# EAGLE design PI_Tank_level_controller (EAGLE 9.3.0)
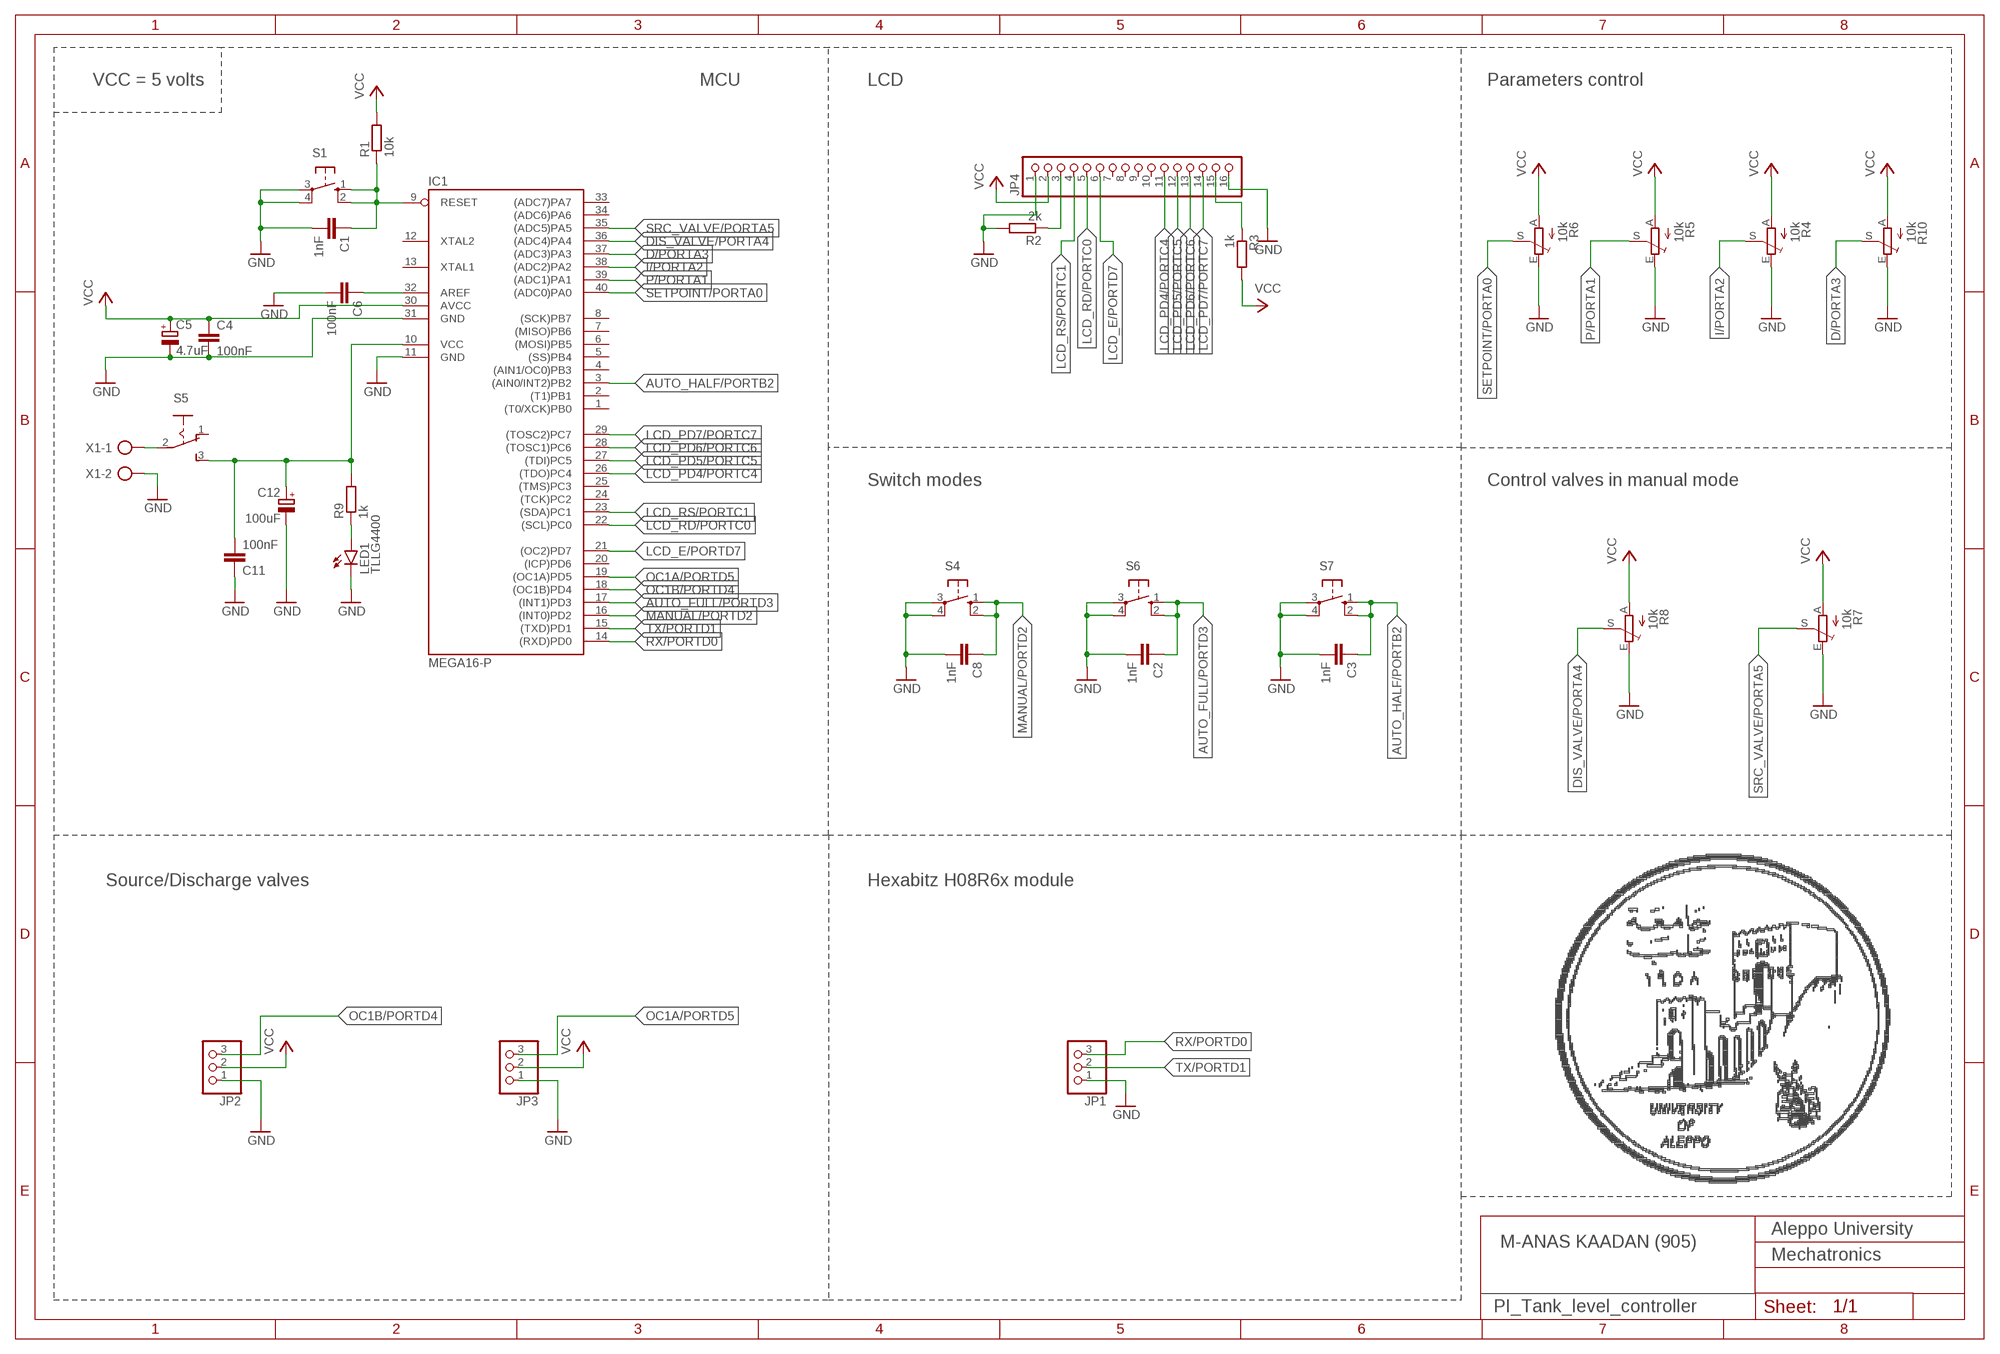
[diagram p0: schematic, sheet 1]

## Parts
C1  1nF  C-EU025-024X044  [C025-024X044]
C2  1nF  C-EU025-024X044  [C025-024X044]
C3  1nF  C-EU025-024X044  [C025-024X044]
C4  100nF  C-EU025-024X044  [C025-024X044]
C5  4.7uF  CPOL-EUE2,5-6E  [E2,5-6E]
C6  100nF  C-EU025-024X044  [C025-024X044]
C8  1nF  C-EU025-024X044  [C025-024X044]
C11  100nF  C-EU025-024X044  [C025-024X044]
C12  100uF  CPOL-EUB45181A  [B45181A]
IC1  MEGA16-P  [DIL40]
JP1  PINHD-1X3  [1X03]
JP2  PINHD-1X3  [1X03]
JP3  PINHD-1X3  [1X03]
JP4  PINHD-1X16  [1X16]
LED1  TLLG4400  [LED3MM]
R1  10k  R-EU_0204/7  [0204/7]
R2  2k  R-EU_0204/7  [0204/7]
R3  1k  R-EU_0204/7  [0204/7]
R4  10k  TRIM_EU-RJ9W  [RJ9W]
R5  10k  TRIM_EU-RJ9W  [RJ9W]
R6  10k  TRIM_EU-RJ9W  [RJ9W]
R7  10k  TRIM_EU-RJ9W  [RJ9W]
R8  10k  TRIM_EU-RJ9W  [RJ9W]
R9  1k  R-EU_0204/7  [0204/7]
R10  10k  TRIM_EU-RJ9W  [RJ9W]
S1  10-XX  [B3F-10XX]
S4  10-XX  [B3F-10XX]
S5  255SB  [255SB]
S6  10-XX  [B3F-10XX]
S7  10-XX  [B3F-10XX]
X1  AK300/2  [AK300/2]

## Nets
AUTO_FULL/PORTD3: C2.1 IC1.17((INT1)PD3) S6.1(S) S6.2(S1)
AUTO_HALF/PORTB2: C3.1 IC1.3((AIN0/INT2)PB2) S7.1(S) S7.2(S1)
D/PORTA3: IC1.37((ADC3)PA3) R10.S
DIS_VALVE/PORTA4: IC1.36((ADC4)PA4) R8.S
GND: C1.2 C2.2 C3.2 C4.2 C5.- C6.2 C8.2 C11.1 C12.- IC1.11(GND) IC1.31(GND) JP1.1 JP2.1 JP3.1 JP4.1 JP4.16 LED1.K(C) R2.2 R4.E R5.E R6.E R7.E R8.E R10.E S1.3(P) S1.4(P1) S4.3(P) S4.4(P1) S6.3(P) S6.4(P1) S7.3(P) S7.4(P1) X1.2
I/PORTA2: IC1.38((ADC2)PA2) R4.S
LCD_E/PORTD7: IC1.21((OC2)PD7) JP4.6
LCD_PD4/PORTC4: IC1.26((TDO)PC4) JP4.11
LCD_PD5/PORTC5: IC1.27((TDI)PC5) JP4.12
LCD_PD6/PORTC6: IC1.28((TOSC1)PC6) JP4.13
LCD_PD7/PORTC7: IC1.29((TOSC2)PC7) JP4.14
LCD_RD/PORTC0: IC1.22((SCL)PC0) JP4.5
LCD_RS/PORTC1: IC1.23((SDA)PC1) JP4.4
MANUAL/PORTD2: C8.1 IC1.16((INT0)PD2) S4.1(S) S4.2(S1)
N$1: C1.1 IC1.9(RESET) R1.1 S1.1(S) S1.2(S1)
N$2: JP4.15 R3.1
N$3: C6.1 IC1.32(AREF)
N$4: JP4.3 R2.1
N$26: S5.2(P) X1.1
N$28: LED1.A R9.1
OC1A/PORTD5: IC1.19((OC1A)PD5) JP3.3
OC1B/PORTD4: IC1.18((OC1B)PD4) JP2.3
P/PORTA1: IC1.39((ADC1)PA1) R5.S
RX/PORTD0: IC1.14((RXD)PD0) JP1.3
SETPOINT/PORTA0: IC1.40((ADC0)PA0) R6.S
SRC_VALVE/PORTA5: IC1.35((ADC5)PA5) R7.S
TX/PORTD1: IC1.15((TXD)PD1) JP1.2
VCC: C4.1 C5.+ C11.2 C12.+ IC1.10(VCC) IC1.30(AVCC) JP2.2 JP3.2 JP4.2 R1.2 R3.2 R4.A R5.A R6.A R7.A R8.A R9.2 R10.A S5.3(S)
Unconnected: IC1.1((T0/XCK)PB0) IC1.2((T1)PB1) IC1.4((AIN1/OC0)PB3) IC1.5((SS)PB4) IC1.6((MOSI)PB5) IC1.7((MISO)PB6) IC1.8((SCK)PB7) IC1.12(XTAL2) IC1.13(XTAL1) IC1.20((ICP)PD6) IC1.24((TCK)PC2) IC1.25((TMS)PC3) IC1.33((ADC7)PA7) IC1.34((ADC6)PA6) JP4.7 JP4.8 JP4.9 JP4.10 S5.1(O)

## Notes on the sheet
- VCC = 5 volts | MCU | LCD | Parameters control
- Switch modes | Control valves in manual mode
- Source/Discharge valves | Hexabitz H08R6x module
- Aleppo University
- M-ANAS KAADAN (905)
- Mechatronics

## Library data of the parts
C1-C4 C6 C8 = rcl:C-EU: CAPACITOR, European symbol; SPICEPREFIX: C
C5 = rcl:CPOL-EU: POLARIZED CAPACITOR, European symbol; SPICEPREFIX: C
C11 = rcl:C-EU: CAPACITOR, European symbol
C12 = rcl:CPOL-EU: POLARIZED CAPACITOR, European symbol
IC1 = atmel:MEGA16-P: MICROCONTROLLER 16 Kbytes FLASH 1 kbytes SRAM 512 bytes EEPROM USART 8-channel 10 bit ADC Source: avr.lbr; MPN: ATMEGA16-16PU; OC_FARNELL: 9171142; OC_NEWARK: 01M6885
JP1-JP3 = pinhead:PINHD-1X3: PIN HEADER
JP4 = pinhead:PINHD-1X16: PIN HEADER
LED1 = led:TLLG4400: Low Current (2mA) LED 3 mm Tinted Diffused Package color GREEN Source: Data sheet <http://www.farnell.com/datasheets/391098.pdf>; MF: VISHAY SEMICONDUCTOR; OC_FARNELL: 1612435
R1-R3 = rcl:R-EU_: RESISTOR, European symbol; SPICEPREFIX: R
R4-R8 R10 = pot:TRIM_EU-: POTENTIOMETER
R9 = rcl:R-EU_: RESISTOR, European symbol
S1 S4 S6 S7 = switch-omron:10-XX: OMRON SWITCH; MPN: B3F-1000; OC_FARNELL: 176432; OC_NEWARK: 36M3542
S5 = switch:255SB: SLIDING SWITCH Distributor Buerklin, 11G810
X1 = con-ptr500:AK300/2: CONNECTOR; OC_FARNELL: unknown; OC_NEWARK: unknown

## Board
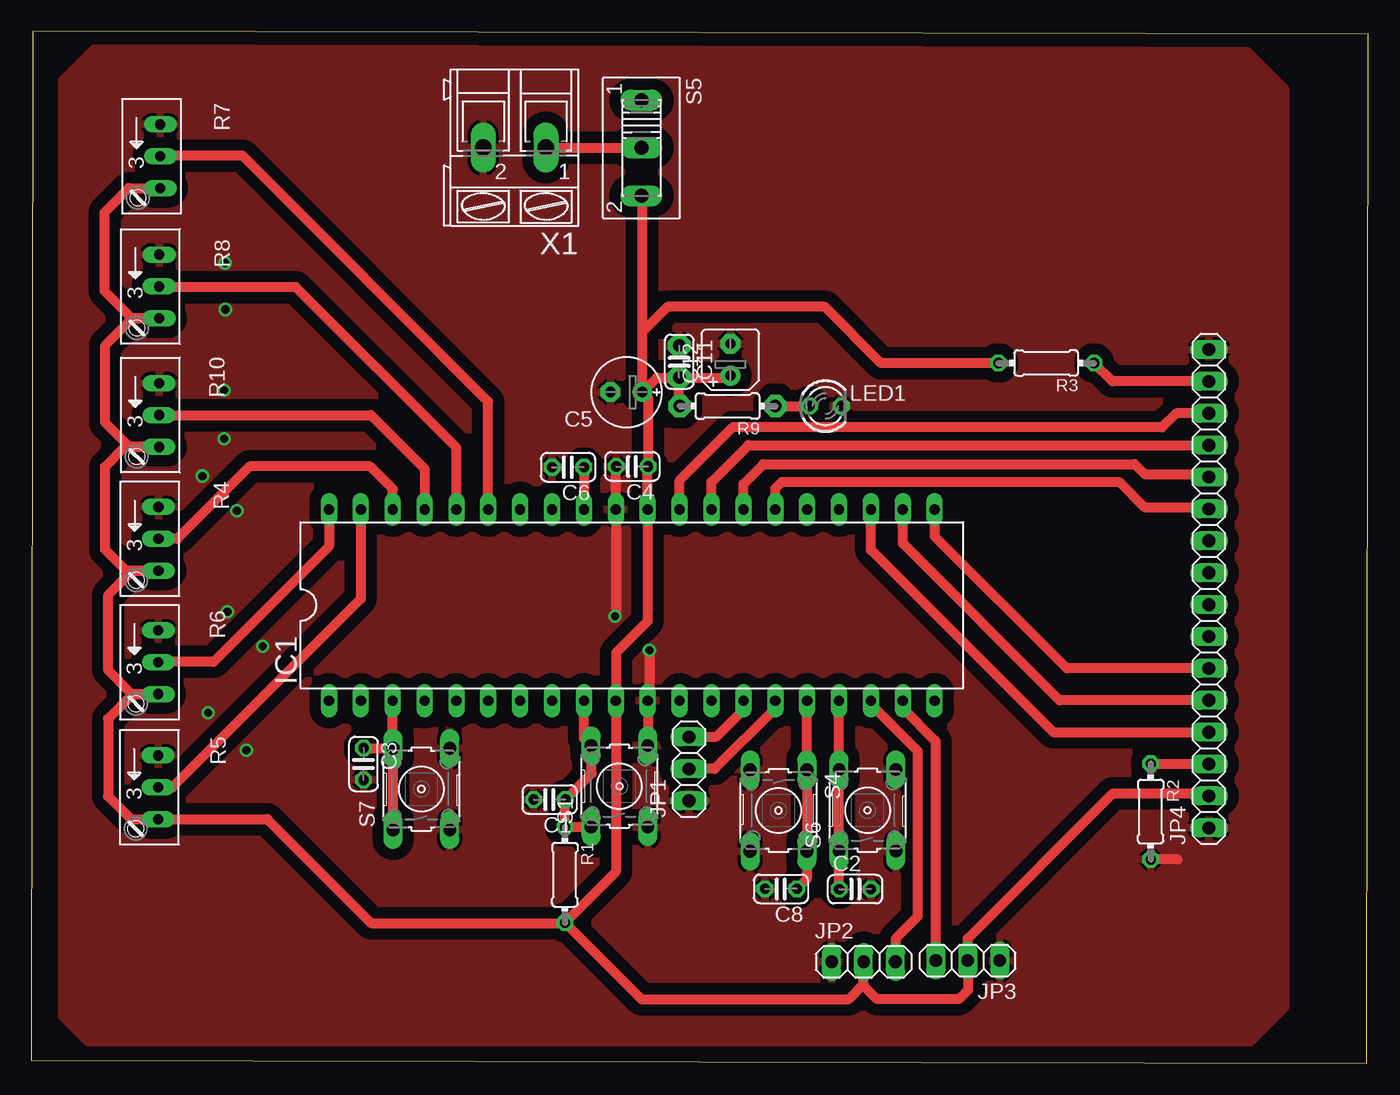
[diagram p1: board, top side]
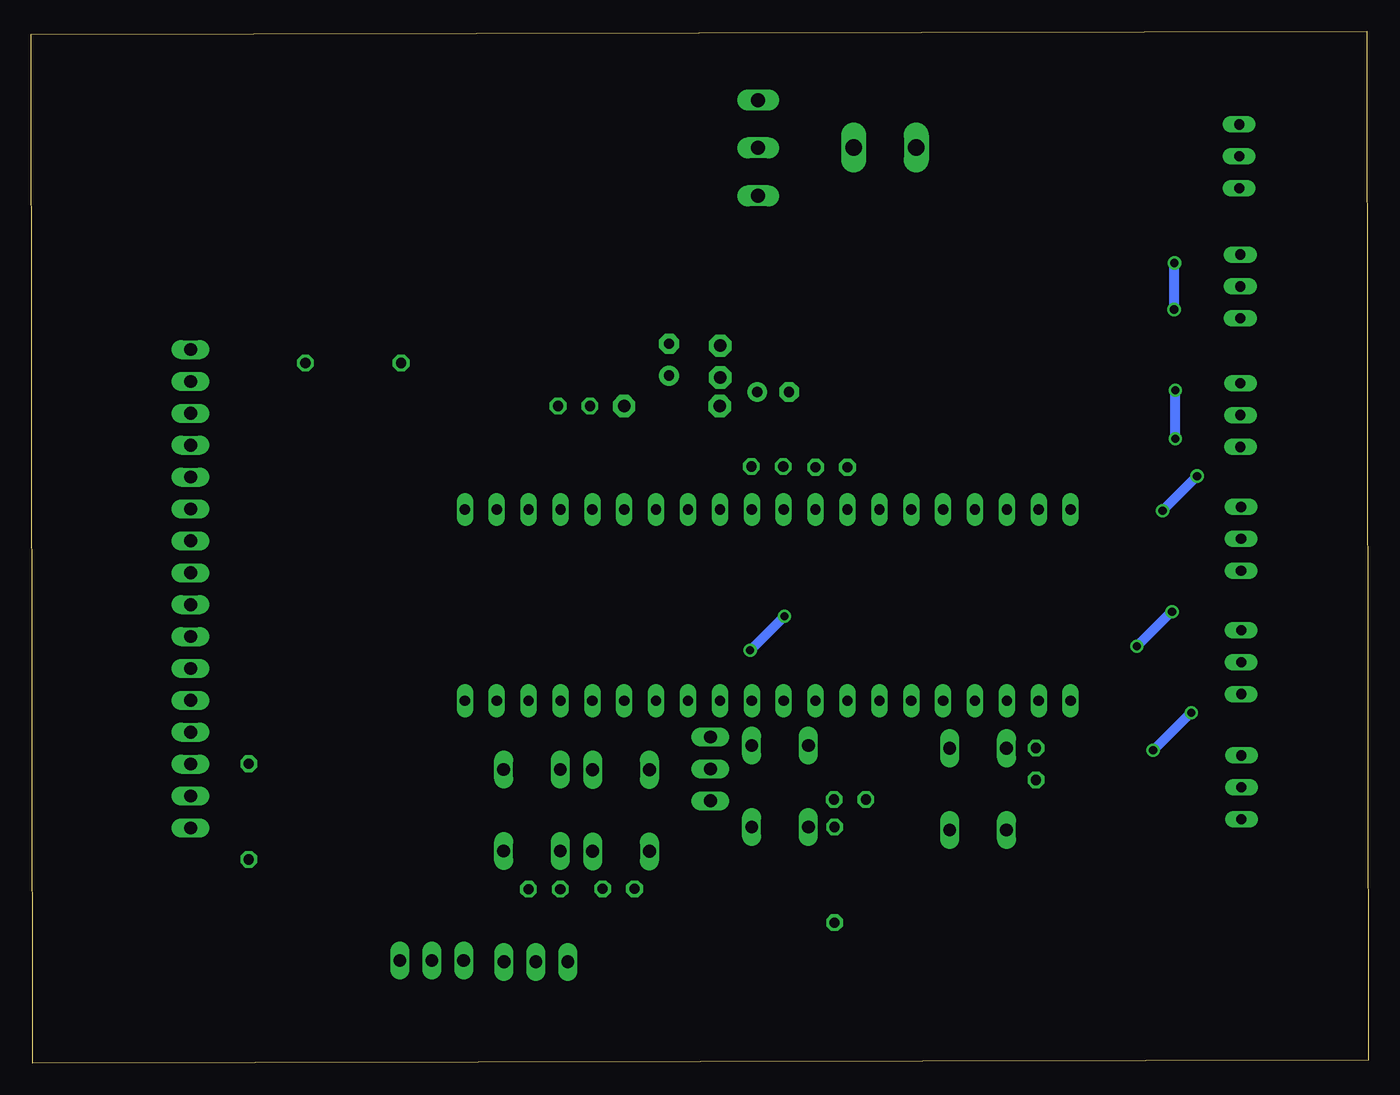
[diagram p2: board, bottom side, seen from below]

Size 106.5 x 82.17 mm. Coordinates in mm from the lower left corner, seen from the top.
Outline: 0,0.21 106.39,0 106.5,81.96 0.11,82.17 0,0.21
Copper layers (1*16): Top 0.035mm / dielectric 1.5mm / Bottom 0.035mm
Design rules "default *": minimum track width 6mil, minimum drill 0.35mm, track to track 6mil, track to pad 6mil, pad to pad 6mil, via to via 6mil, smd to smd 6mil, copper to edge 40mil, drill to drill 6mil, minimum pad ring 10mil, minimum via ring 8mil, stop-mask expansion 4mil, vias tented up to drill 0mil, thermal gap 10mil

### Footprints (pad centres in the part's own frame; a part is rotated, then mirrored left to right if it is on the bottom)
C025-024X044 = drill 0.813 octagon: 1 -1.27,0; 2 1.27,0
E2,5-6E = drill 0.813 pad 1.575: + -1.27,0 | drill 0.813 pad 1.575 octagon: - 1.27,0
C025-024X044' = drill 1 pad 1.778 octagon: 1 -1.27,0; 2 1.27,0
B45181A = drill 0.813 pad 1.6: + -1.27,0 | drill 0.813 pad 1.6 octagon: - 1.27,0
DIL40 = drill 0.813 long: 1 -24.13,-7.62; 2 -21.59,-7.62; 3 -19.05,-7.62; 4 -16.51,-7.62; 5 -13.97,-7.62; 6 -11.43,-7.62; 7 -8.89,-7.62; 8 -6.35,-7.62; 9 -3.81,-7.62; 10 -1.27,-7.62; 11 1.27,-7.62; 12 3.81,-7.62; 13 6.35,-7.62; 14 8.89,-7.62; 15 11.43,-7.62; 16 13.97,-7.62; 17 16.51,-7.62; 18 19.05,-7.62; 19 21.59,-7.62; 20 24.13,-7.62; 21 24.13,7.62; 22 21.59,7.62; 23 19.05,7.62; 24 16.51,7.62; 25 13.97,7.62; 26 11.43,7.62; 27 8.89,7.62; 28 6.35,7.62; 29 3.81,7.62; 30 1.27,7.62; 31 -1.27,7.62; 32 -3.81,7.62; 33 -6.35,7.62; 34 -8.89,7.62; 35 -11.43,7.62; 36 -13.97,7.62; 37 -16.51,7.62; 38 -19.05,7.62; 39 -21.59,7.62; 40 -24.13,7.62
1X03 = drill 1.016 long: 1 -2.54,0; 2 0,0; 3 2.54,0
1X16 = drill 1.016 long: 1 -19.05,0; 2 -16.51,0; 3 -13.97,0; 4 -11.43,0; 5 -8.89,0; 6 -6.35,0; 7 -3.81,0; 8 -1.27,0; 9 1.27,0; 10 3.81,0; 11 6.35,0; 12 8.89,0; 13 11.43,0; 14 13.97,0; 15 16.51,0; 16 19.05,0
LED3MM = drill 0.813 octagon: A -1.27,0; K 1.27,0
0204/7 = drill 0.813 octagon: 1 -3.81,0; 2 3.81,0
RJ9W = drill 0.813 long: A 2.54,0.635; E -2.54,0.635; S 0,0.635
0204/7' = drill 1 pad 1.778 octagon: 1 -3.81,0; 2 3.81,0
B3F-10XX = drill 1.016 long: 1 -3.251,2.261; 2 3.251,2.261; 3 -3.251,-2.261; 4 3.251,-2.261
255SB = drill 1.118 long: 1 -3.81,0; 2 0,0; 3 3.81,0
AK300/2 = drill 1.321 long: 1 -2.515,0; 2 2.489,0

### Placement (x,y rotation side)
C1  41.29,21 180 top
C2  65.63,13.86 0 top
C3  26.46,23.83 270 top
C4  47.87,47.52 180 top
C5  47.4,53.45 180 top
C6  42.75,47.46 180 top
C8  59.72,13.88 180 top
C11  100nF  [C025-024X044']  51.61,55.87 270 top
C12  55.69,56.03 90 top
IC1  47.84,36.48 0 top
JP1  52.4,23.44 90 top
JP2  66.3,8.07 0 top
JP3  74.6,8.17 180 top
JP4  93.82,37.79 90 top
LED1  63.27,52.34 0 top
R1  42.51,15 270 top
R2  89.18,20.04 270 top
R3  80.86,55.76 180 top
R4  9.49,41.76 270 top
R5  9.46,21.97 270 top
R6  9.48,31.94 270 top
R7  9.64,72.22 270 top
R8  9.55,61.86 270 top
R9  1k  [0204/7']  55.47,52.33 180 top
R10  9.54,51.62 270 top
S1  46.85,22.05 90 top
S4  59.52,20.12 270 top
S5  48.61,72.89 270 top
S6  66.61,20.14 90 top
S7  31.07,21.83 90 top
X1  38.48,72.91 180 top

### Tracks (layer width: path | path; a pad name or v marks a point on that pad's centre or on a via)
AUTO_FULL/PORTD3
  Top 0.813: C2.1 64.36,16.88 S6.1 S6.2 64.35,28.85 IC1.17
AUTO_HALF/PORTB2
  Top 0.813: S7.1 S7.2 | C3.1 28.8,25.1 S7.2 | S7.2 28.79,25.11 IC1.3
D/PORTA3
  Top 0.813: R10.S 27.07,51.62 31.33,47.36 IC1.37
DIS_VALVE/PORTA4
  Top 0.813: IC1.36 33.87,49.01 21.07,61.8 10.24,61.8 R8.S
GND  (via drill 0.65)
  Top 0.813: S1.4 49.16,25.35 49.16,28.92 49.24,28.99 v49.24,32.89 | v46.5,35.6 46.57,35.67 IC1.31 46.57,47.49 C4.2 | 91.31,16.23 R2.2
  Bottom 0.813: v49.24,32.89 49.2,32.89 v46.5,35.6 | v17.13,24.91 14.14,27.9 v14.08,27.9 | v18.42,33.21 15.67,35.96 v15.62,35.96 | v16.38,44 v13.63,46.75 | v15.36,49.73 v15.36,53.6 | v15.46,60.03 15.46,63.7 v15.43,63.73
  pour Top (isolate 0.889): 4.95,80.84 96.7,80.84 99.95,77.59 99.95,4.43 97.14,1.63 4.48,1.63 2.41,3.69 2.41,78.3
I/PORTA2
  Top 0.813: IC1.38 28.79,45.74 26.98,47.54 17.4,47.54 11.63,41.76 R4.S
LCD_E/PORTD7
  Top 0.813: JP4.6 82.5,31.44 71.97,41.97 IC1.21
LCD_PD4/PORTC4
  Top 0.813: JP4.11 93.68,44.28 88.68,44.28 86.67,46.29 59.79,46.29 59.27,45.77 IC1.26
LCD_PD5/PORTC5
  Top 0.813: IC1.27 56.73,46.12 58.33,47.72 87.9,47.72 88.7,46.92 93.58,46.92 JP4.12
LCD_PD6/PORTC6
  Top 0.813: IC1.28 54.19,46.28 57.12,49.22 JP4.13
LCD_PD7/PORTC7
  Top 0.813: IC1.29 51.65,46.41 55.88,50.64 90.09,50.64 91.2,51.76 JP4.14
LCD_RD/PORTC0
  Top 0.813: JP4.5 81.92,28.9 69.43,41.39 IC1.22
LCD_RS/PORTC1
  Top 0.813: JP4.4 81.42,26.36 66.89,40.89 IC1.23
MANUAL/PORTD2
  Top 0.813: IC1.16 61.78,28.84 S4.1 S4.2 61.78,14.67 C8.1
N$1
  Top 0.813: IC1.9 44.03,25.87 S1.2 44.53,25.24 44.65,25.12 44.65,23.09 C1.1 42.51,20.95 R1.1 S1.1
N$2
  Top 0.813: JP4.15 86.14,54.3 R3.1
N$3
  Top 0.813: C6.1 IC1.32
N$4
  Top 0.813: R2.1 93.79,23.85 JP4.3
N$26
  Top 0.813: X1.1 48.59,72.91 S5.2
N$28
  Top 0.813: R9.1 61.98,52.33 LED1.A
OC1A/PORTD5
  Top 0.813: JP3.3 72.03,8.2 72.03,25.65 69.43,28.26 IC1.19
OC1B/PORTD4
  Top 0.813: IC1.18 66.89,28.59 70.61,24.86 70.61,11.66 68.84,9.9 JP2.3
P/PORTA1
  Top 0.813: IC1.39 26.25,36.98 11.24,21.97 R5.S
RX/PORTD0
  Top 0.813: JP1.3 52.43,26 54.57,26 56.73,28.16 IC1.14
SETPOINT/PORTA0
  Top 0.813: IC1.40 23.71,41.16 14.51,31.96 10.14,31.96 R6.S
SRC_VALVE/PORTA5
  Top 0.813: IC1.35 36.41,52.69 16.82,72.28 10.33,72.28 R7.S
TX/PORTD1
  Top 0.813: IC1.15 59.27,28.26 54.45,23.44 JP1.2
VCC
  Top 0.813: C11.2 55.53,54.6 C12.+ | C5.+ 49.14,52.98 C4.1 49.11,47.49 IC1.30 49.11,35.21 46.58,32.69 46.58,28.88 IC1.10 46.57,15.25 R1.2 | S5.3 48.67,69.02 C5.+ | R3.2 67.69,55.76 63.23,60.22 50.7,60.22 48.67,58.2 C5.+ | JP4.2 93.6,21.49 86.18,21.49 74.61,9.92 JP3.2 74.65,8.13 74.65,5.83 73.91,5.1 67.38,5.1 66.3,6.18 JP2.2 66.3,6.27 65.13,5.1 48.6,5.1 R1.2 | R7.A 7.74,69.68 5.82,67.76 5.82,61.49 7.99,59.32 R8.A 8.05,59.32 5.89,57.16 5.89,50.99 7.8,49.08 R10.A 7.44,49.08 5.87,47.51 5.87,40.91 7.56,39.22 R4.A 8.05,39.22 6.13,37.3 6.13,31.27 8.01,29.4 R6.A 8.07,29.4 6.12,27.44 6.12,21.24 7.94,19.43 R5.A 18.8,19.43 27.07,11.16 42.48,11.16 R1.2 | R9.2 51.61,52.37 C11.2 | C5.+ 49.83,54.6 C11.2